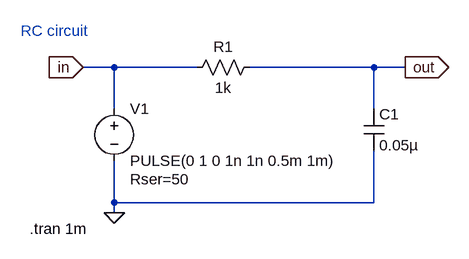
[diagram p0: schematic RC_circuit.asc]
RC_circuit.asc, the LTspice schematic file:
Version 4
SHEET 1 880 680
WIRE 16 128 -32 128
WIRE 144 128 16 128
WIRE 416 128 224 128
WIRE 464 128 416 128
WIRE 16 192 16 128
WIRE 416 192 416 128
WIRE 16 336 16 272
WIRE 416 336 416 256
WIRE 416 336 16 336
WIRE 16 352 16 336
FLAG 16 352 0
FLAG -32 128 in
IOPIN -32 128 In
FLAG 464 128 out
IOPIN 464 128 Out
SYMBOL voltage 16 176 R0
WINDOW 123 0 0 Left 2
WINDOW 39 24 124 Left 2
SYMATTR InstName V1
SYMATTR Value PULSE(0 1 0 1n 1n 0.5m 1m)
SYMATTR SpiceLine Rser=50
SYMBOL res 128 144 R270
WINDOW 0 32 56 VTop 2
WINDOW 3 0 56 VBottom 2
SYMATTR InstName R1
SYMATTR Value 1k
SYMBOL cap 400 192 R0
SYMATTR InstName C1
SYMATTR Value 0.05µ
TEXT -114 376 Left 2 !.tran 1m
TEXT -128 72 Left 2 ;RC circuit

The netlist it stands for:
* RC_circuit.asc
V1 in 0 PULSE(0 1 0 1n 1n 0.5m 1m) Rser=50
R1 in out 1k
C1 out 0 0.05µ
.tran 1m
* RC circuit
.backanno
.end

* Results of the author's LTspice run, read from the files saved beside the schematic
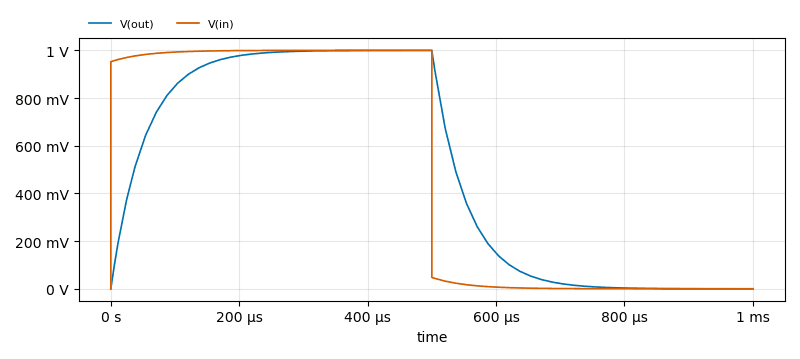
[diagram p1: Transient Analysis of RC_circuit.asc, plotted from the saved traces]
* Transient Analysis, 1 run:
*   V(out): min 0 V, max 999.9 mV, average 500.1 mV, rms 669.4 mV, last 73.07 µV
*   V(in): min 0 V, max 1 V, average 500 mV, rms 703.6 mV, last 3.479 µV